# EAGLE design uv-light-sensor (EAGLE 7.4.0)
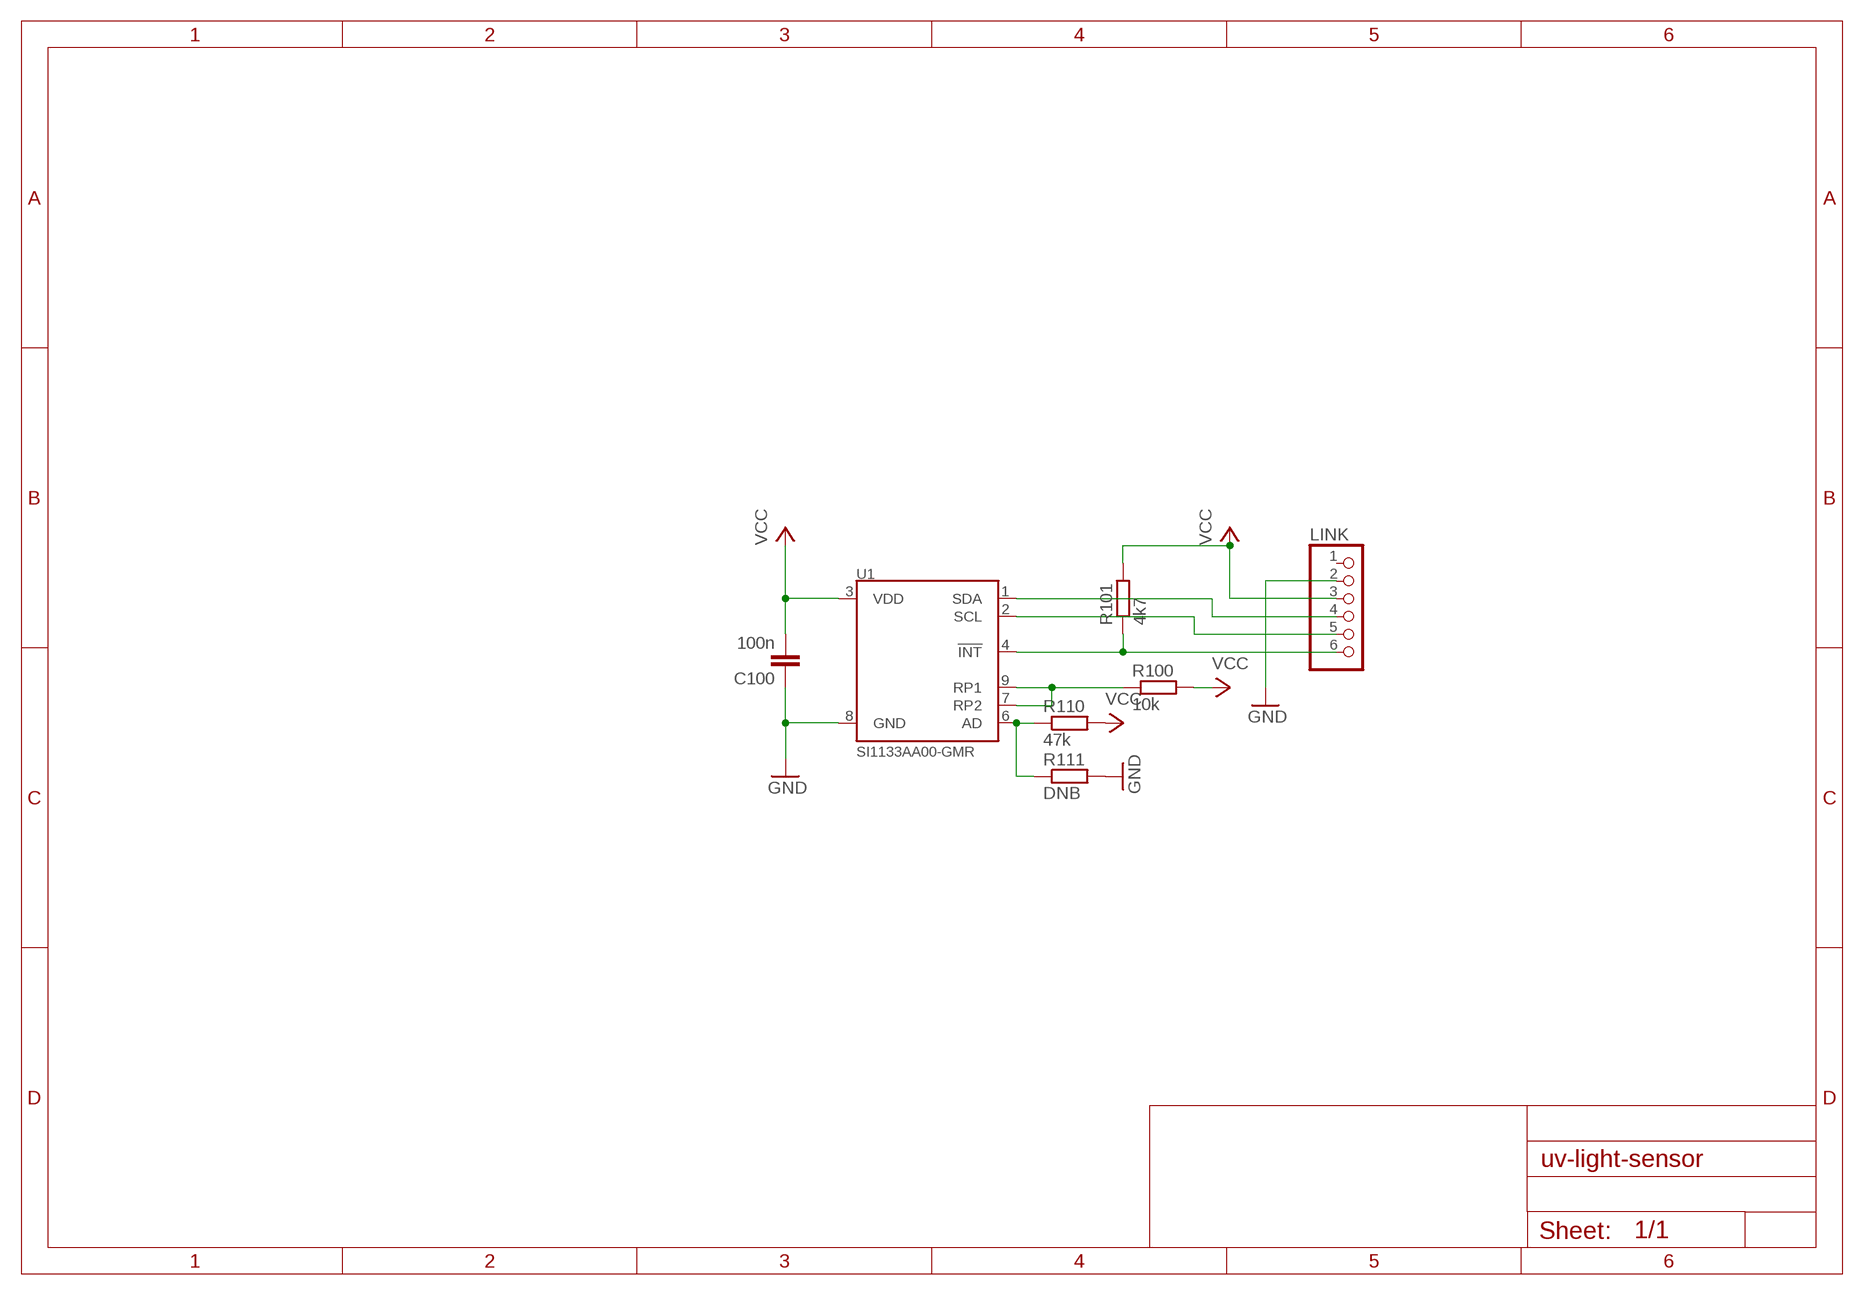
[diagram p0: schematic, sheet 1]

## Parts
C100  100n  C-EUC0603  [C0603]
LINK  PINHD-1X6  [1X06]
R100  10k  R-EU_R0603  [R0603]
R101  4k7  R-EU_R0603  [R0603]
R110  47k  R-EU_R0603  [R0603]
R111  DNB  R-EU_R0603  [R0603]
U1  SI1133AA00-GMR  [QFN-10/2MM]

## Nets
GND: C100.1 LINK.2 R111.2 U1.8(GND)
N$1: LINK.6 R101.1 U1.4(!INT)
N$2: LINK.5 U1.2(SCL)
N$3: LINK.4 U1.1(SDA)
N$5: R100.1 U1.7(RP2) U1.9(RP1)
N$6: R110.1 R111.1 U1.6(AD)
VCC: C100.2 LINK.3 R100.2 R101.2 R110.2 U1.3(VDD)
Unconnected: LINK.1

## Library data of the parts
C100 = rcl:C-EU: CAPACITOR, European symbol
LINK = pinhead:PINHD-1X6: PIN HEADER
R100 R101 R110 R111 = rcl:R-EU_: RESISTOR, European symbol
U1 = weather_station:SI1133: SENSOR DGTL UV INDEX 10QFN

## Board
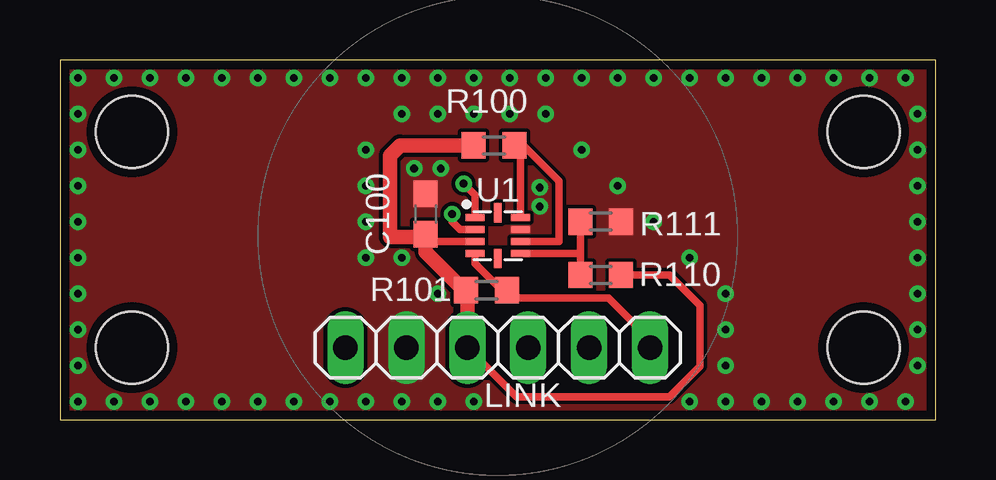
[diagram p1: board, top side]
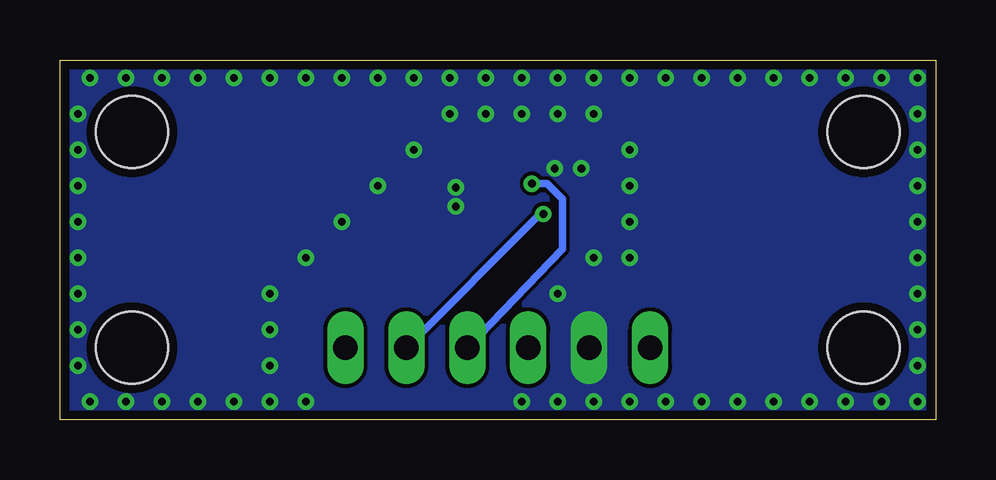
[diagram p2: board, bottom side, seen from below]

Size 36.5 x 15 mm. Coordinates in mm from the lower left corner, seen from the top.
Outline: 0,0 36.5,0 36.5,15 0,15 0,0
Copper layers (1*16): Top 0.0356mm / dielectric 1.5011mm / Bottom 0.0356mm
Design rules "LaenPCBOrder (1)": minimum track width 6mil, minimum drill 13mil, track to track 6mil, track to pad 6mil, pad to pad 6mil, via to via 6mil, smd to smd 6mil, copper to edge 15mil, drill to drill 6mil, minimum pad ring 7mil, minimum via ring 7mil, stop-mask expansion 3mil, vias tented up to drill 0mil, thermal gap 10mil
Holes 3 mm at 33.5,3 3,3 3,12 33.5,12

### Footprints (pad centres in the part's own frame; a part is rotated, then mirrored left to right if it is on the bottom)
C0603 = smd 1.1 x 1: 1 -0.85,0; 2 0.85,0
1X06 = drill 1.016 long: 1 -6.35,0; 2 -3.81,0; 3 -1.27,0; 4 1.27,0; 5 3.81,0; 6 6.35,0
R0603 = smd 1 x 1.1: 1 -0.85,0; 2 0.85,0
QFN-10/2MM = smd 0.8 x 0.3: 1 -0.95,0.75; 2 -0.95,0.25; 3 -0.95,-0.25; 4 -0.95,-0.75; 6 0.95,-0.75; 7 0.95,-0.25; 8 0.95,0.25; 9 0.95,0.75 | smd 0.3 x 0.8: 5 0,-0.95; 10 0,0.95

### Placement (x,y rotation side)
C100  15.24,8.57 270 top
LINK  18.25,3 0 top
R100  18.1,11.43 180 top
R101  17.78,5.4 180 top
R110  22.54,6.03 0 top
R111  22.54,8.26 0 top
U1  18.25,7.67 0 top

### Tracks (layer width: path | path; a pad name or v marks a point on that pad's centre or on a via)
GND  (via drill 0.33)
  other vias: 0.75,0.75 14.76,10.48 15.88,10.48 20,9.68 20,8.89 0.75,2.25 0.75,3.75 0.75,5.25 0.75,6.75 0.75,8.25 0.75,9.75 0.75,11.25 2.25,0.75 3.75,0.75 5.25,0.75 6.75,0.75 8.25,0.75 9.75,0.75 11.25,0.75 12.75,0.75 14.25,0.75 15.75,0.75 17.25,0.75 26.25,0.75 27.75,0.75 29.25,0.75 30.75,0.75 32.25,0.75 33.75,0.75 35.25,0.75 35.75,12.75 0.75,12.75 0.75,14.25 2.25,14.25 3.75,14.25 5.25,14.25 6.75,14.25 8.25,14.25 9.75,14.25 11.25,14.25 12.75,14.25 14.25,14.25 15.75,14.25 17.25,14.25 18.75,14.25 20.25,14.25 21.75,14.25 23.25,14.25 24.75,14.25 26.25,14.25 27.75,14.25 29.25,14.25 30.75,14.25 32.25,14.25 33.75,14.25 35.25,14.25 35.75,11.25 35.75,9.75 35.75,8.25 35.75,6.75 35.75,5.25 35.75,3.75 35.75,2.25 15.75,5.25 14.25,6.75 12.75,6.75 12.75,8.25 12.75,9.75 12.75,11.25 14.25,12.75 15.75,12.75 17.25,12.75 18.75,12.75 20.25,12.75 21.75,11.25 23.25,9.75 24.75,8.25 26.25,6.75 27.75,5.25 27.75,3.75 27.75,2.25
  pour Top (no thermals): -0.75,16 -0.75,-2.25 38.73,-2.25 38.73,16
  pour Bottom (no thermals): -0.75,16.75 42.48,16.75 40.98,-1.5 -1.5,-1.5
N$1
  Top 0.305: LINK.6 24.6,3.34 22.86,5.08 18.95,5.08 R101.1 18.41,5.4 17.3,6.51 U1.4
N$2  (via drill 0.33)
  Top 0.305: U1.2 16.68,7.92 16.35,8.26 v16.35,8.57
  Bottom 0.305: v16.35,8.57 16.49,8.57 LINK.5
N$3  (via drill 0.33)
  Top 0.305: U1.1 17.3,9.37 v16.83,9.84
  Bottom 0.305: v16.83,9.84 16.19,9.84 15.56,9.21 15.56,7.12 LINK.4
N$5
  Top 0.305: U1.7 20.8,7.42 20.8,9.95 19.32,11.43 R100.1 19.2,11.18 U1.9
N$6
  Top 0.305: U1.6 21.69,6.92 | 21.69,6.92 R110.1 | R111.1 21.69,6.92
VCC
  Top 0.305: C100.2 15.54,7.42 U1.3 | R110.2 25.4,6.03 26.67,4.76 26.67,2.22 25.4,0.95 19.03,0.95 LINK.3
  Top 0.61: R100.2 14.17,11.43 13.76,11.01 13.76,7.62 15.24,7.62 C100.2 15.24,6.99 16.83,5.4 R101.2 16.98,5.35 LINK.3